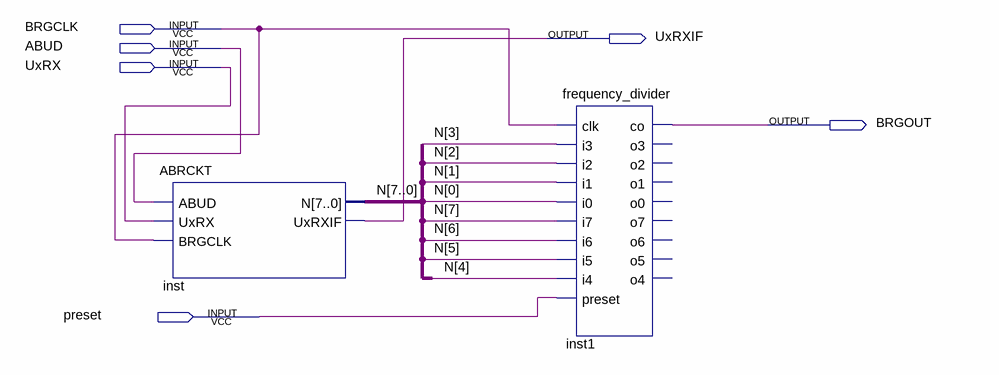
[diagram p0: schematic sheet]
// Quartus schematic BRGCKT.bdf as structural Verilog: 2 symbols, 6 pins
module BRGCKT (
  input  BRGCLK,
  input  ABUD,
  input  UxRX,
  input  preset,
  output UxRXIF,
  output BRGOUT
);

  wire [7:0] N;

  ABRCKT inst (.ABUD(ABUD), .UxRX(UxRX), .BRGCLK(BRGCLK), .N(N), .UxRXIF(UxRXIF));
  frequency_divider inst1 (
    .clk(BRGCLK), .i3(N[3]), .i2(N[2]), .i1(N[1]), .i0(N[0]), .i7(N[7]), .i6(N[6]), .i5(N[5]), .i4(N[4]),
    .preset(preset), .co(BRGOUT));  // open: o3, o2, o1, o0, o7, o6, o5, o4
endmodule
